# EAGLE design Genesis V1.0 (EAGLE 7.2.0)
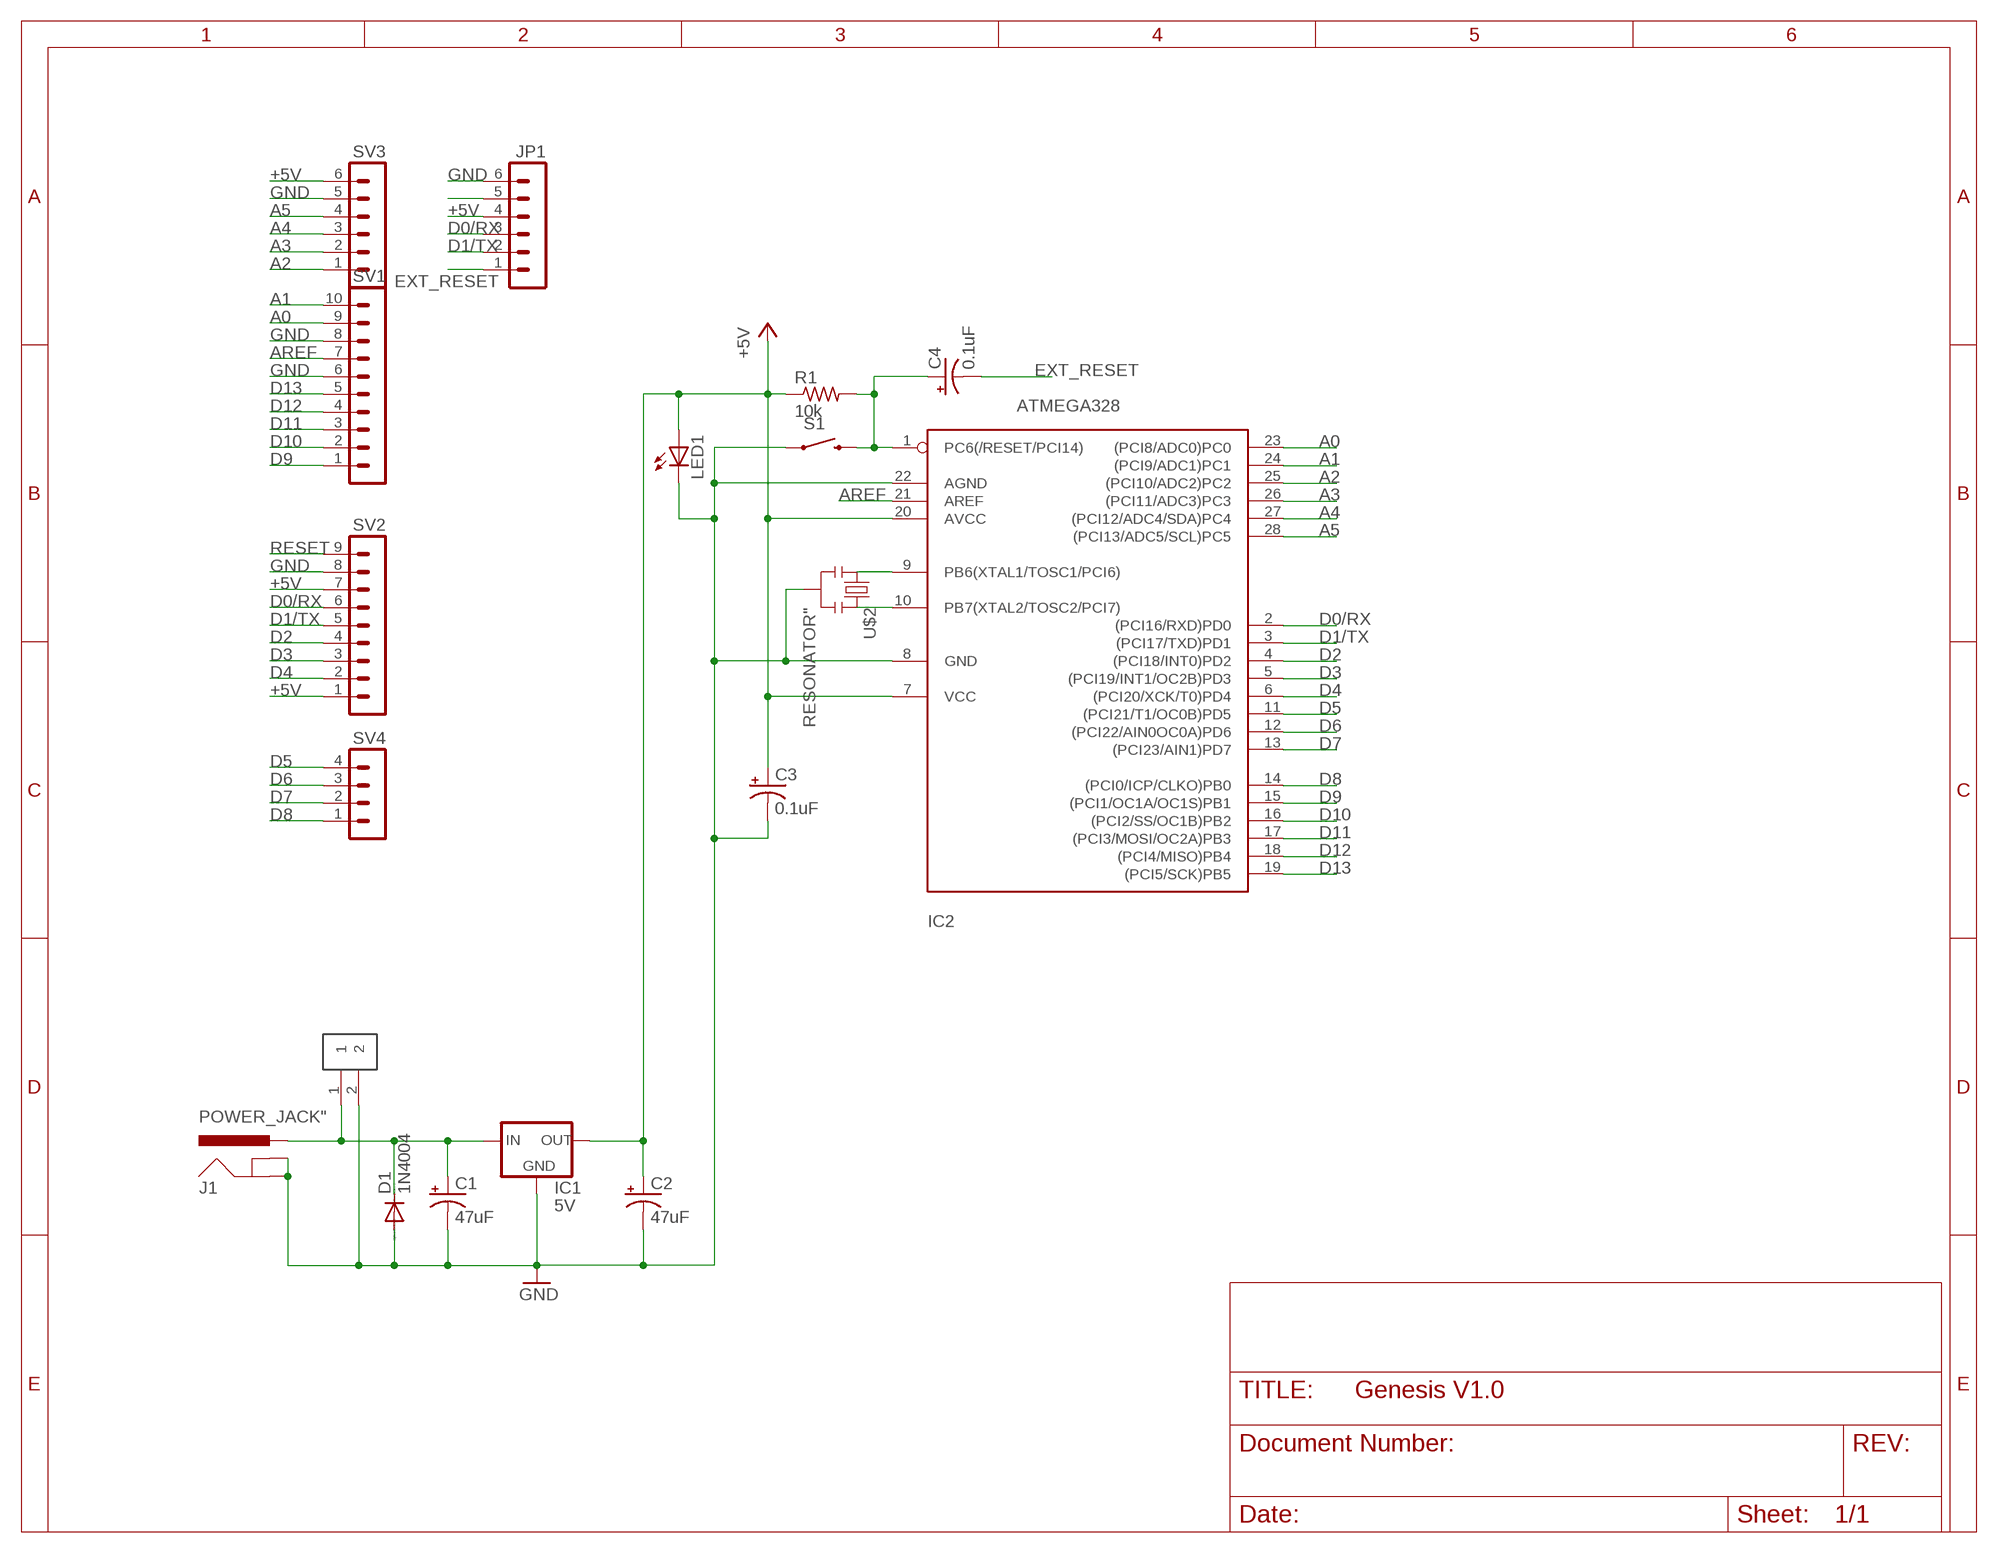
[diagram p0: schematic, sheet 1]

## Parts
C1  47uF  ELECTROLYTIC_CAP2.54MM  [ELECTROLYTIC_CAP]
C2  47uF  ELECTROLYTIC_CAP2.54MM  [ELECTROLYTIC_CAP]
C3  0.1uF  ELECTROLYTIC_CAP2.54MM  [ELECTROLYTIC_CAP]
C4  0.1uF  ELECTROLYTIC_CAP2.54MM  [ELECTROLYTIC_CAP]
D1  1N4004  [DO41-10]
IC1  5V  REGULATOR  [L4931_REGULATOR]
IC2  ATMEGA328  ATMEGA328"  [ATMEGA328]
J1  POWER_JACK"  [POWER_JACK]
JP1  MA06-1  [MA06-1]
LED1  LED3MM  [LED]
R1  10k  RESISTOR1/6WATT  [RESISTOR]
S1  MOMENTARY_SWITCH"  [MOMENTARY_SWITCH]
SV1  MA10-1  [MA10-1]
SV2  MA09-1  [MA09-1]
SV3  MA06-1  [MA06-1]
SV4  MA04-1  [MA04-1]
U$1  1X02_HEADER  [1X02_HEADER]
U$2  RESONATOR"  [RESONATOR]

## Nets
+5V: C2.+ C3.+ IC1.OUT IC2.7(VCC) IC2.20(AVCC) JP1.4 LED1.A R1.1 SV2.1 SV2.7 SV3.6
A0: IC2.23((PCI8/ADC0)PC0) SV1.9
A1: IC2.24((PCI9/ADC1)PC1) SV1.10
A2: IC2.25((PCI10/ADC2)PC2) SV3.1
A3: IC2.26((PCI11/ADC3)PC3) SV3.2
A4: IC2.27((PCI12/ADC4/SDA)PC4) SV3.3
A5: IC2.28((PCI13/ADC5/SCL)PC5) SV3.4
AREF: IC2.21(AREF) SV1.7
D0/RX: IC2.2((PCI16/RXD)PD0) JP1.3 SV2.6
D1/TX: IC2.3((PCI17/TXD)PD1) JP1.2 SV2.5
D2: IC2.4((PCI18/INT0)PD2) SV2.4
D3: IC2.5((PCI19/INT1/OC2B)PD3) SV2.3
D4: IC2.6((PCI20/XCK/T0)PD4) SV2.2
D5: IC2.11((PCI21/T1/OC0B)PD5) SV4.4
D6: IC2.12((PCI22/AIN0OC0A)PD6) SV4.3
D7: IC2.13((PCI23/AIN1)PD7) SV4.2
D8: IC2.14((PCI0/ICP/CLKO)PB0) SV4.1
D9: IC2.15((PCI1/OC1A/OC1S)PB1) SV1.1
D10: IC2.16((PCI2/SS/OC1B)PB2) SV1.2
D11: IC2.17((PCI3/MOSI/OC2A)PB3) SV1.3
D12: IC2.18((PCI4/MISO)PB4) SV1.4
D13: IC2.19((PCI5/SCK)PB5) SV1.5
EXT_RESET: C4.- JP1.1
GND: C1.- C2.- C3.- D1.A IC1.GND IC2.8(GND) IC2.22(AGND) J1.GND J1.GNDBREAK JP1.6 LED1.K(C) S1.1 SV1.6 SV1.8 SV2.8 SV3.5 U$1.2 U$2.2
N$1: C1.+ D1.C IC1.IN J1.PWR U$1.1
N$3: IC2.9(PB6(XTAL1/TOSC1/PCI6)) U$2.1
N$4: IC2.10(PB7(XTAL2/TOSC2/PCI7)) U$2.3
N$5: JP1.5
RESET: C4.+ IC2.1(PC6(/RESET/PCI14)) R1.2 S1.3 SV2.9

## Library data of the parts
C1-C4 = RBBB:ELECTROLYTIC_CAP: POLARIZED CAPACITOR, American symbol
D1 = diode:1N4004: DIODE general purpose rectifier, 1 A
IC1 = RBBB:REGULATOR: VOLTAGE REGULATOR
IC2 = RBBB:ATMEGA328: MICROCONTROLLER 16 kBytes FLASH 1 kBytes SRAM 512 Bytes EEPROM USART 8-channel 10 bit ADC
J1 = RBBB:POWER_JACK: Power Jack This is the standard 5.5mm barrel jack for power. The PTH is the most common, proven, reliable, footprint. All others are experimental. The Slot footprint only works if the mill layer is transmitted to the PCB fab house so be warned. Spark Fun Electronics SKU : PRT-00119. Mating wall wart : TOL-00298 (and others)
JP1 SV3 = con-lstb:MA06-1: PIN HEADER; OC_FARNELL: unknown; OC_NEWARK: unknown
LED1 = RBBB:LED: LED OSRAM: - CHIPLED LG R971, LG N971, LY N971, LG Q971, LY Q971, LO R971, LY R971 LH N974, LH R974 LS Q976, LO Q976, LY Q976 LO Q996 - Hyper CHIPLED LW Q18S LB Q993, LB Q99A, LB R99A - SideLED LS A670, LO A670, LY A670, LG A670, LP A670 LB A673, LV A673, LT A673, LW A673 LH A674 LY A675 LS A676, LA A676, LO A676, LY A676, LW A676 LS A679, LY A679, LG A679 - Hyper Micro SIDELED® LS Y876, LA Y876, LO Y876, LY Y876 LT Y87S - SmartLED LW L88C, LW L88S LB L89C, LB L89S, LG L890 LS L89K, LO L89K, LY L89K LS L896, LA L896, LO L896, LY L896 - TOPLED LS T670, LO T670, LY T670, LG T670, LP T670 LSG T670, LSP T670, LSY T670, LOP T670, LYG T670 LG T671, LOG T671, LSG T671 LB T673, LV T673, LT T673, LW T673 LH T674 LS T676, LA T676, LO T676, LY T676, LB T676, LH T676, LSB T676, LW T676 LB T67C, LV T67C, LT T67C, LS T67K, LO T67K, LY T67K, LW E67C LS E67B, LA E67B, LO E67B, LY E67B, LB E67C, LV E67C, LT E67C LW T67C LS T679, LY T679, LG T679 LS T770, LO T770, LY T770, LG T770, LP T770 LB T773, LV T773, LT T773, LW T773 LH T774 LS E675, LA E675, LY E675, LS T675 LS T776, LA T776, LO T776, LY T776, LB T776 LHGB T686 LT T68C, LB T68C - Hyper Mini TOPLED® LB M676 - Mini TOPLED Santana® LG M470 LS M47K, LO M47K, LY M47K Source: http://www.osram.convergy.de LUXEON: - LUMILED® LXK2-PW12-R00, LXK2-PW12-S00, LXK2-PW14-U00, LXK2-PW14-V00 LXK2-PM12-R00, LXK2-PM12-S00, LXK2-PM14-U00 LXK2-PE12-Q00, LXK2-PE12-R00, LXK2-PE12-S00, LXK2-PE14-T00, LXK2-PE14-U00 LXK2-PB12-K00, LXK2-PB12-L00, LXK2-PB12-M00, LXK2-PB14-N00, LXK2-PB14-P00, LXK2-PB14-Q00 LXK2-PR12-L00, LXK2-PR12-M00, LXK2-PR14-Q00, LXK2-PR14-R00 LXK2-PD12-Q00, LXK2-PD12-R00, LXK2-PD12-S00 LXK2-PH12-R00, LXK2-PH12-S00 LXK2-PL12-P00, LXK2-PL12-Q00, LXK2-PL12-R00 Source: www.luxeon.com KINGBRIGHT: KA-3528ASYC Source: www.kingbright.com
R1 = RBBB:RESISTOR: RESISTOR, American symbol
S1 = RBBB:MOMENTARY_SWITCH
SV1 = con-lstb:MA10-1: PIN HEADER; OC_FARNELL: unknown; OC_NEWARK: unknown
SV2 = con-lstb:MA09-1: PIN HEADER; OC_FARNELL: unknown; OC_NEWARK: unknown
SV4 = con-lstb:MA04-1: PIN HEADER; OC_FARNELL: unknown; OC_NEWARK: unknown
U$1 = RBBB:1X02_HEADER
U$2 = RBBB:RESONATOR: Resonator Small SMD resonator. This is the itty bitty 10/20MHz resonators with built in caps. CSTCE10M0G55 and CSTCE20M0V53. Footprint has been reviewed closely but hasn t been tested yet.'

## Board
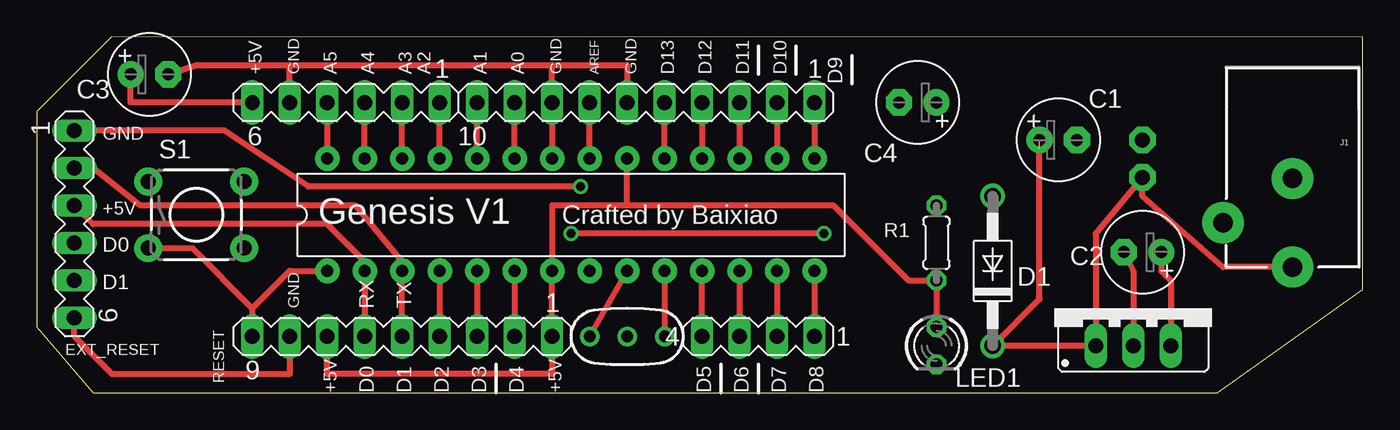
[diagram p1: board, top side]
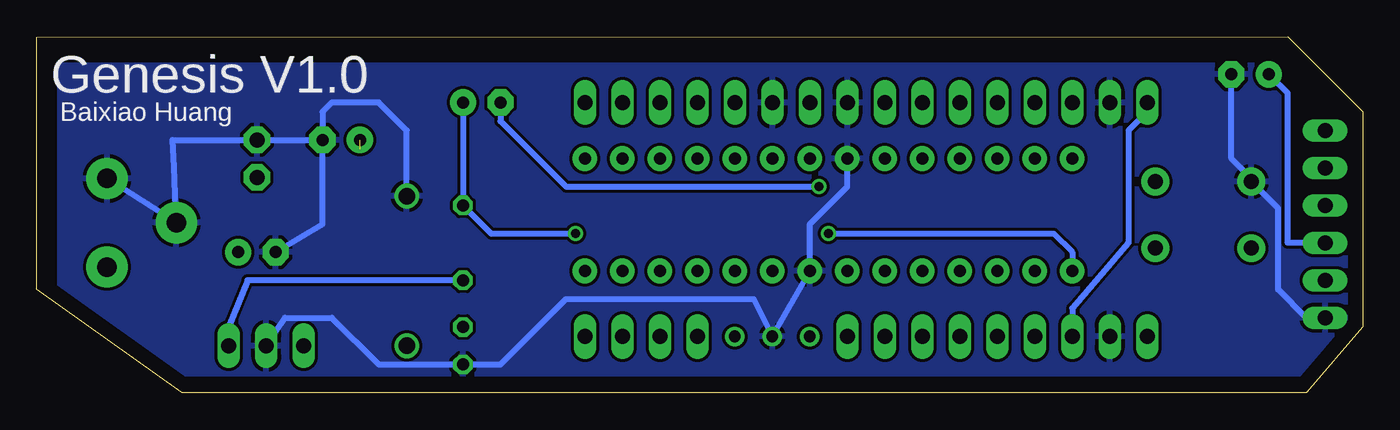
[diagram p2: board, bottom side, seen from below]

Size 89.84 x 24.13 mm. Coordinates in mm from the lower left corner, seen from the top.
Outline: 0,4.45 3.81,0 80.01,0 89.84,6.99 89.84,24.12 5.08,24.13 0,19.05 0,4.45
Copper layers (1*16): Top 0.035mm / dielectric 1.5mm / Bottom 0.035mm
Design rules "default": minimum track width 10mil, minimum drill 24mil, track to track 8mil, track to pad 8mil, pad to pad 8mil, via to via 8mil, smd to smd 8mil, copper to edge 40mil, drill to drill 8mil, minimum pad ring 10mil, minimum via ring 8mil, stop-mask expansion 4mil, vias tented up to drill 0mil, thermal gap 10mil

### Footprints (pad centres in the part's own frame; a part is rotated, then mirrored left to right if it is on the bottom)
ELECTROLYTIC_CAP = drill 0.813 pad 1.778: + -1.27,0 | drill 0.813 pad 1.778 octagon: - 1.27,0
DO41-10 = drill 1.118: A 5.08,0; C -5.08,0
L4931_REGULATOR = drill 1.016 long: GND 0,-2.54; IN -2.54,-2.54; OUT 2.54,-2.54
ATMEGA328 = drill 0.813 pad 1.676: 1 -16.51,-3.81; 2 -13.97,-3.81; 3 -11.43,-3.81; 4 -8.89,-3.81; 5 -6.35,-3.81; 6 -3.81,-3.81; 7 -1.27,-3.81; 8 1.27,-3.81; 9 3.81,-3.81; 10 6.35,-3.81; 11 8.89,-3.81; 12 11.43,-3.81; 13 13.97,-3.81; 14 16.51,-3.81; 15 16.51,3.81; 16 13.97,3.81; 17 11.43,3.81; 18 8.89,3.81; 19 6.35,3.81; 20 3.81,3.81; 21 1.27,3.81; 22 -1.27,3.81; 23 -3.81,3.81; 24 -6.35,3.81; 25 -8.89,3.81; 26 -11.43,3.81; 27 -13.97,3.81; 28 -16.51,3.81
POWER_JACK = drill 1.321 pad 2.794: GND 0,7.7; GNDBREAK 4.7,10.7; PWR 0,13.7
MA06-1 = drill 1.016 long: 1 -6.35,0; 2 -3.81,0; 3 -1.27,0; 4 1.27,0; 5 3.81,0; 6 6.35,0
LED = drill 0.813 octagon: A -1.27,0; K 1.27,0
RESISTOR = drill 0.813 octagon: 1 -2.54,0; 2 2.54,0
MOMENTARY_SWITCH = drill 1.016 pad 1.88: 1 -3.251,2.261; 2 3.251,2.261; 3 -3.251,-2.261; 4 3.251,-2.261
MA10-1 = drill 1.016 long: 1 -11.43,0; 2 -8.89,0; 3 -6.35,0; 4 -3.81,0; 5 -1.27,0; 6 1.27,0; 7 3.81,0; 8 6.35,0; 9 8.89,0; 10 11.43,0
MA09-1 = drill 1.016 long: 1 -10.16,0; 2 -7.62,0; 3 -5.08,0; 4 -2.54,0; 5 0,0; 6 2.54,0; 7 5.08,0; 8 7.62,0; 9 10.16,0
MA04-1 = drill 1.016 long: 1 -3.81,0; 2 -1.27,0; 3 1.27,0; 4 3.81,0
1X02_HEADER = drill 1.016 pad 1.778 octagon: 1 -1.27,0; 2 1.27,0
RESONATOR = drill 0.8: 1 -2.54,0; 2 0,0; 3 2.54,0

### Placement (x,y rotation side)
C1  69.22,17.14 0 top
C2  74.93,9.53 180 top
C3  7.62,21.59 0 top
C4  59.69,19.68 180 top
D1  64.77,8.26 90 top
IC1  74.3,5.71 0 top
IC2  36.2,12.06 0 top
J1  85.09,22.22 180 top
JP1  2.54,11.43 270 top
LED1  60.96,3.17 270 top
R1  60.96,10.16 90 top
S1  10.79,12.06 0 top
SV1  41.27,19.68 180 top
SV2  24.77,3.81 180 top
SV3  20.96,19.68 180 top
SV4  48.89,3.81 180 top
U$1  74.93,15.88 90 top
U$2  40,3.81 0 top

### Tracks (layer width: path | path; a pad name or v marks a point on that pad's centre or on a via)
+5V
  Top 0.406: SV2.7 19.69,1.27 34.92,1.27 SV2.1 IC2.7 34.92,12.7 40,12.7 | C2.+ 76.2,8.26 76.84,7.62 IC1.OUT | 40,12.7 53.98,12.7 59.05,7.62 R1.1 LED1.A | 40,12.7 IC2.20 | SV3.6 6.35,19.68 C3.+
  Bottom 0.406: SV3.6 14.61,19.05 15.88,17.78 15.88,10.16 19.69,5.71 SV2.7 | JP1.4 5.08,10.16 5.08,20.32 C3.+ | R1.1 75.57,7.62 76.84,4.45 IC1.OUT
A0
  Top 0.406: IC2.23 SV1.9
A1
  Top 0.406: IC2.24 SV1.10
A2
  Top 0.406: IC2.25 SV3.1
A3
  Top 0.406: IC2.26 SV3.2
A4
  Top 0.406: IC2.27 SV3.3
A5
  Top 0.406: SV3.4 IC2.28
AREF
  Top 0.406: IC2.21 SV1.7
D0/RX
  Top 0.406: SV2.6 IC2.2 22.23,8.89 19.69,11.43 3.81,11.43 JP1.3
D1/TX
  Top 0.406: SV2.5 IC2.3 24.77,8.89 21.59,12.7 6.98,12.7 3.81,15.24 JP1.2
D2
  Top 0.406: IC2.4 SV2.4
D3
  Top 0.406: IC2.5 SV2.3
D4
  Top 0.406: IC2.6 SV2.2
D5
  Top 0.406: SV4.4 IC2.11
D6
  Top 0.406: IC2.12 SV4.3
D7
  Top 0.406: IC2.13 SV4.2
D8
  Top 0.406: IC2.14 SV4.1
D9
  Top 0.406: SV1.1 IC2.15
D10
  Top 0.406: SV1.2 IC2.16
D11
  Top 0.406: SV1.3 IC2.17
D12
  Top 0.406: SV1.4 IC2.18
D13
  Top 0.406: IC2.19 SV1.5
EXT_RESET  (via drill 0.6)
  Top 0.406: v36.83,13.97 18.42,13.97 12.7,17.78 JP1.1
  Bottom 0.406: C4.- 58.42,18.41 53.98,13.97 v36.83,13.97
GND
  Top 0.406: C2.- 74.3,8.26 IC1.GND | C3.- 10.79,22.22 17.15,22.22 | SV3.5 17.15,22.22 | 17.15,22.22 34.92,22.22 | 34.92,22.22 SV1.8 IC2.22 | 34.92,22.22 40,22.22 SV1.6 | SV2.8 17.15,1.27 5.08,1.27 2.54,3.81 JP1.6
  Bottom 0.406: D1.A 64.77,17.78 66.68,19.68 69.85,19.68 70.48,19.05 C1.- | C1.- U$1.2 80.65,17.14 80.55,15.34 J1.GNDBREAK J1.GND | C2.- 70.48,11.43 C1.- | IC2.22 34.92,13.97 37.46,11.43 IC2.8 U$2.2 41.27,6.35 53.98,6.35 58.42,1.91 LED1.K 66.68,1.91 69.85,5.08 73.03,5.08 IC1.GND | JP1.6 3.81,5.08 5.71,6.99 5.71,12.5 S1.1 7.54,14.53 8.89,15.88 C3.-
  pour Bottom: 0.64,19.05 0.64,4.45 3.17,1.27 83.19,1.27 88.27,5.08 88.27,22.22 4.45,22.22
N$1  (1 unrouted)
  Top 0.406: 67.95,16.51 67.95,6.35 D1.C IC1.IN 71.76,10.79 U$1.1 74.93,13.34 80.38,8.53 J1.PWR
N$3
  Top 0.406: IC2.9 U$2.1
N$4
  Top 0.406: IC2.10 U$2.3
RESET  (via drill 0.6, 0.6 pad 1.02)
  Top 0.406: 14.61,5.71 17.15,8.26 IC2.1 | v53.34,10.79 v36.2,10.79 | S1.3 10.52,9.8 14.61,5.71 | 14.61,5.71 SV2.9
  Bottom 0.406: C4.+ R1.2 59.05,10.79 v53.34,10.79 | v36.2,10.79 20.96,10.79 19.69,9.53 IC2.1

### Text on the board
tNames: +5V | GND | A5 | A4 | A3 | A2 | A1 | A0 | GND | AREF | GND | D13 | D12 | D11 | D10 | D9 | GND | +5V | Genesis V1 | Crafted by Baixiao | D0 | D1 | GND | RX | TX | EXT_RESET | RESET | +5V | D0 | D1 | D2 | D3 | D4 | +5V | D5 | D6 | D7 | D8
bNames: Genesis V1.0 | Baixiao Huang